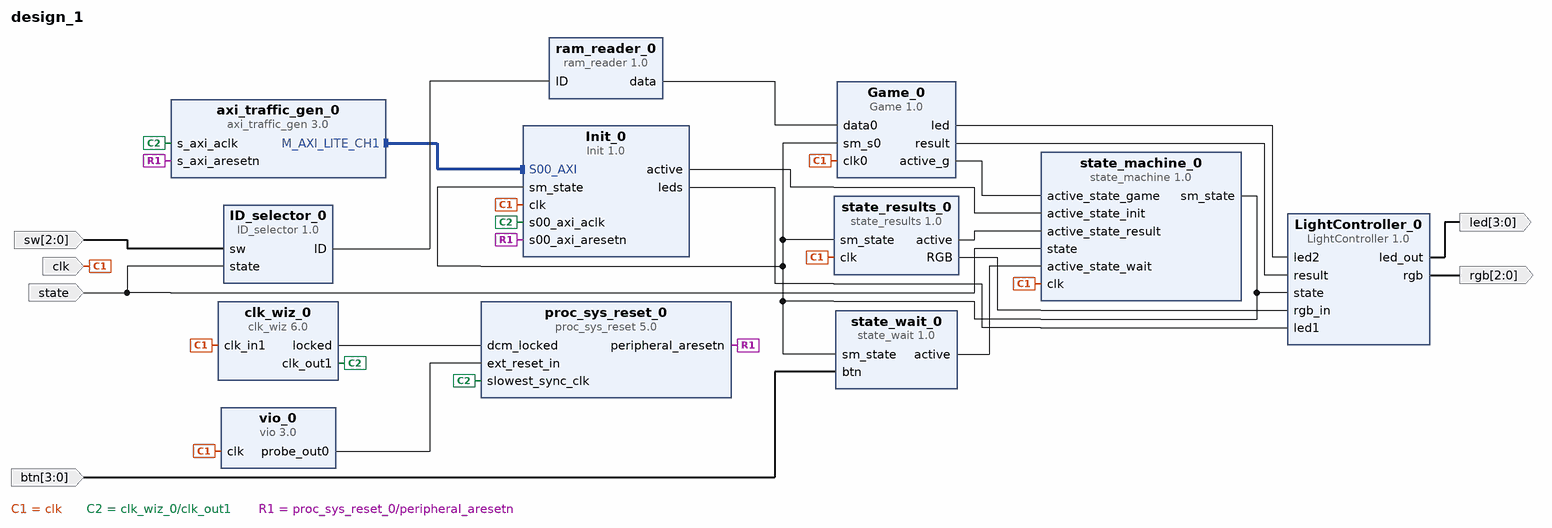
[diagram p0: block diagram of the top level]
# Vivado block design design_1, xc7z010clg400-1, Vivado 2020.1
create_bd_design design_1

create_bd_port -dir I -type clk clk
create_bd_port -dir I state
create_bd_port -dir I -from 3 -to 0 btn
create_bd_port -dir I -from 2 -to 0 sw
create_bd_port -dir O -from 3 -to 0 led
create_bd_port -dir O -from 2 -to 0 rgb

create_bd_cell -type ip -vlnv xilinx.com:user:ID_selector:1.0 ID_selector_0
create_bd_cell -type ip -vlnv xilinx.com:user:ram_reader:1.0 ram_reader_0
create_bd_cell -type ip -vlnv xilinx.com:user:state_machine:1.0 state_machine_0
create_bd_cell -type ip -vlnv xilinx.com:user:state_wait:1.0 state_wait_0
create_bd_cell -type ip -vlnv xilinx.com:user:Game:1.0 Game_0
create_bd_cell -type ip -vlnv xilinx.com:user:LightController:1.0 LightController_0
create_bd_cell -type ip -vlnv xilinx.com:ip:vio:3.0 vio_0
set_property -dict {CONFIG.C_NUM_PROBE_IN 0 CONFIG.C_NUM_PROBE_OUT 1 CONFIG.C_PROBE_OUT0_INIT_VAL 0x1} [get_bd_cells vio_0]
create_bd_cell -type ip -vlnv xilinx.com:ip:clk_wiz:6.0 clk_wiz_0
set_property -dict {CONFIG.USE_RESET false} [get_bd_cells clk_wiz_0]
create_bd_cell -type ip -vlnv xilinx.com:ip:proc_sys_reset:5.0 proc_sys_reset_0
create_bd_cell -type ip -vlnv xilinx.com:ip:axi_traffic_gen:3.0 axi_traffic_gen_0
set_property -dict [list \
  CONFIG.C_ATG_MODE AXI4-Lite \
  CONFIG.C_ATG_SYSINIT_MODES System_Test \
  CONFIG.C_ATG_SYSTEM_CMD_MAX_RETRY 2147483647 \
  CONFIG.C_ATG_SYSTEM_INIT_ADDR_MIF ../../../../../../../axi_files/addr.coe \
  CONFIG.C_ATG_SYSTEM_INIT_CTRL_MIF ../../../../../../../axi_files/ctrl.coe \
  CONFIG.C_ATG_SYSTEM_INIT_DATA_MIF ../../../../../../../axi_files/data.coe \
  CONFIG.C_ATG_SYSTEM_INIT_MASK_MIF ../../../../../../../axi_files/mask.coe \
] [get_bd_cells axi_traffic_gen_0]
create_bd_cell -type ip -vlnv xilinx.com:user:state_results:1.0 state_results_0
create_bd_cell -type ip -vlnv xilinx.com:user:Init:1.0 Init_0

# ---- connections ----

connect_bd_intf_net [get_bd_intf_pins axi_traffic_gen_0/M_AXI_LITE_CH1] [get_bd_intf_pins Init_0/S00_AXI]
connect_bd_net [get_bd_pins ID_selector_0/ID] [get_bd_pins ram_reader_0/ID]
connect_bd_net -net clk_0_1 [get_bd_ports clk] \
  [get_bd_pins state_machine_0/clk] [get_bd_pins Game_0/clk0] [get_bd_pins vio_0/clk] [get_bd_pins clk_wiz_0/clk_in1] \
  [get_bd_pins state_results_0/clk] [get_bd_pins Init_0/clk]
connect_bd_net [get_bd_pins state_machine_0/sm_state] \
  [get_bd_pins state_wait_0/sm_state] [get_bd_pins Game_0/sm_s0] [get_bd_pins state_results_0/sm_state] \
  [get_bd_pins LightController_0/state] [get_bd_pins Init_0/sm_state]
connect_bd_net -net state_0_1 [get_bd_ports state] [get_bd_pins state_machine_0/state] [get_bd_pins ID_selector_0/state]
connect_bd_net [get_bd_pins state_wait_0/active] [get_bd_pins state_machine_0/active_state_wait]
connect_bd_net [get_bd_pins Game_0/active_g] [get_bd_pins state_machine_0/active_state_game]
connect_bd_net [get_bd_pins state_results_0/active] [get_bd_pins state_machine_0/active_state_result]
connect_bd_net [get_bd_pins state_results_0/RGB] [get_bd_pins LightController_0/rgb_in]
connect_bd_net [get_bd_pins Game_0/led] [get_bd_pins LightController_0/led2]
connect_bd_net [get_bd_pins ram_reader_0/data] [get_bd_pins Game_0/data0]
connect_bd_net -net btn_0_1 [get_bd_ports btn] [get_bd_pins state_wait_0/btn]
connect_bd_net -net sw_0_1 [get_bd_ports sw] [get_bd_pins ID_selector_0/sw]
connect_bd_net [get_bd_pins clk_wiz_0/clk_out1] \
  [get_bd_pins proc_sys_reset_0/slowest_sync_clk] [get_bd_pins axi_traffic_gen_0/s_axi_aclk] \
  [get_bd_pins Init_0/s00_axi_aclk]
connect_bd_net [get_bd_pins clk_wiz_0/locked] [get_bd_pins proc_sys_reset_0/dcm_locked]
connect_bd_net [get_bd_pins vio_0/probe_out0] [get_bd_pins proc_sys_reset_0/ext_reset_in]
connect_bd_net [get_bd_pins proc_sys_reset_0/peripheral_aresetn] [get_bd_pins axi_traffic_gen_0/s_axi_aresetn] [get_bd_pins Init_0/s00_axi_aresetn]
connect_bd_net [get_bd_pins Init_0/leds] [get_bd_pins LightController_0/led1]
connect_bd_net [get_bd_pins Game_0/result] [get_bd_pins LightController_0/result]
connect_bd_net [get_bd_pins LightController_0/led_out] [get_bd_ports led]
connect_bd_net [get_bd_pins LightController_0/rgb] [get_bd_ports rgb]
connect_bd_net [get_bd_pins Init_0/active] [get_bd_pins state_machine_0/active_state_init]

validate_bd_design
save_bd_design
